# Altium schematic sheet P-MOS.SchDoc: P-MOS
size A4; CompanyName: github.com/aKaReZa75; Revision: 1.0; SheetNumber: 1; SheetTotal: 1; Project_Name: Design Template
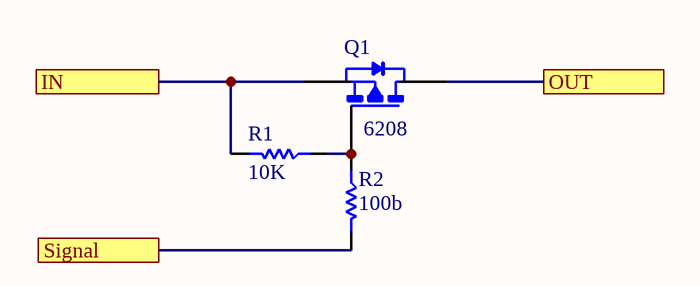
[diagram p0: P-MOS.SchDoc]

## Parts
Q1  Inflow: 6208  [SOT23_N]  (hidden comment: P-Channel)
R1  10K  [RES 0805 (2012X06L)]
R2  100b  [RES 0805 (2012X06L)]

## Ports
IN, OUT, Signal

## Nets
IN: Q1.2(S) R1.2 ; port IN
OUT: Q1.3(D) ; port OUT
Signal: R2.2 ; port Signal
NetQ1_1: Q1.1(G) R1.1 R2.1

## Notes on the sheet
- Title:
- Project:
- Drawn by:
- Revision:
- Hossein Bagheri
- Company:
- Sheet
- of

## Library data of the parts
Q1 = Semi_MOSFET_Si2301DS: P-Channel MOSFET; Rating: Rating?; Type: Type?; Value: P-Channel; Package: Package?
R1 R2 = Res_SMD_0805: Resistor; Inflow: inflow?; Rating: 0.125W; Package: 0805; Type: 10%
  R1: Value: 10K
  R2: Value: 100b